# Altium project TIMESTICK_2.1.3.PrjPcb (part 2 of 2)
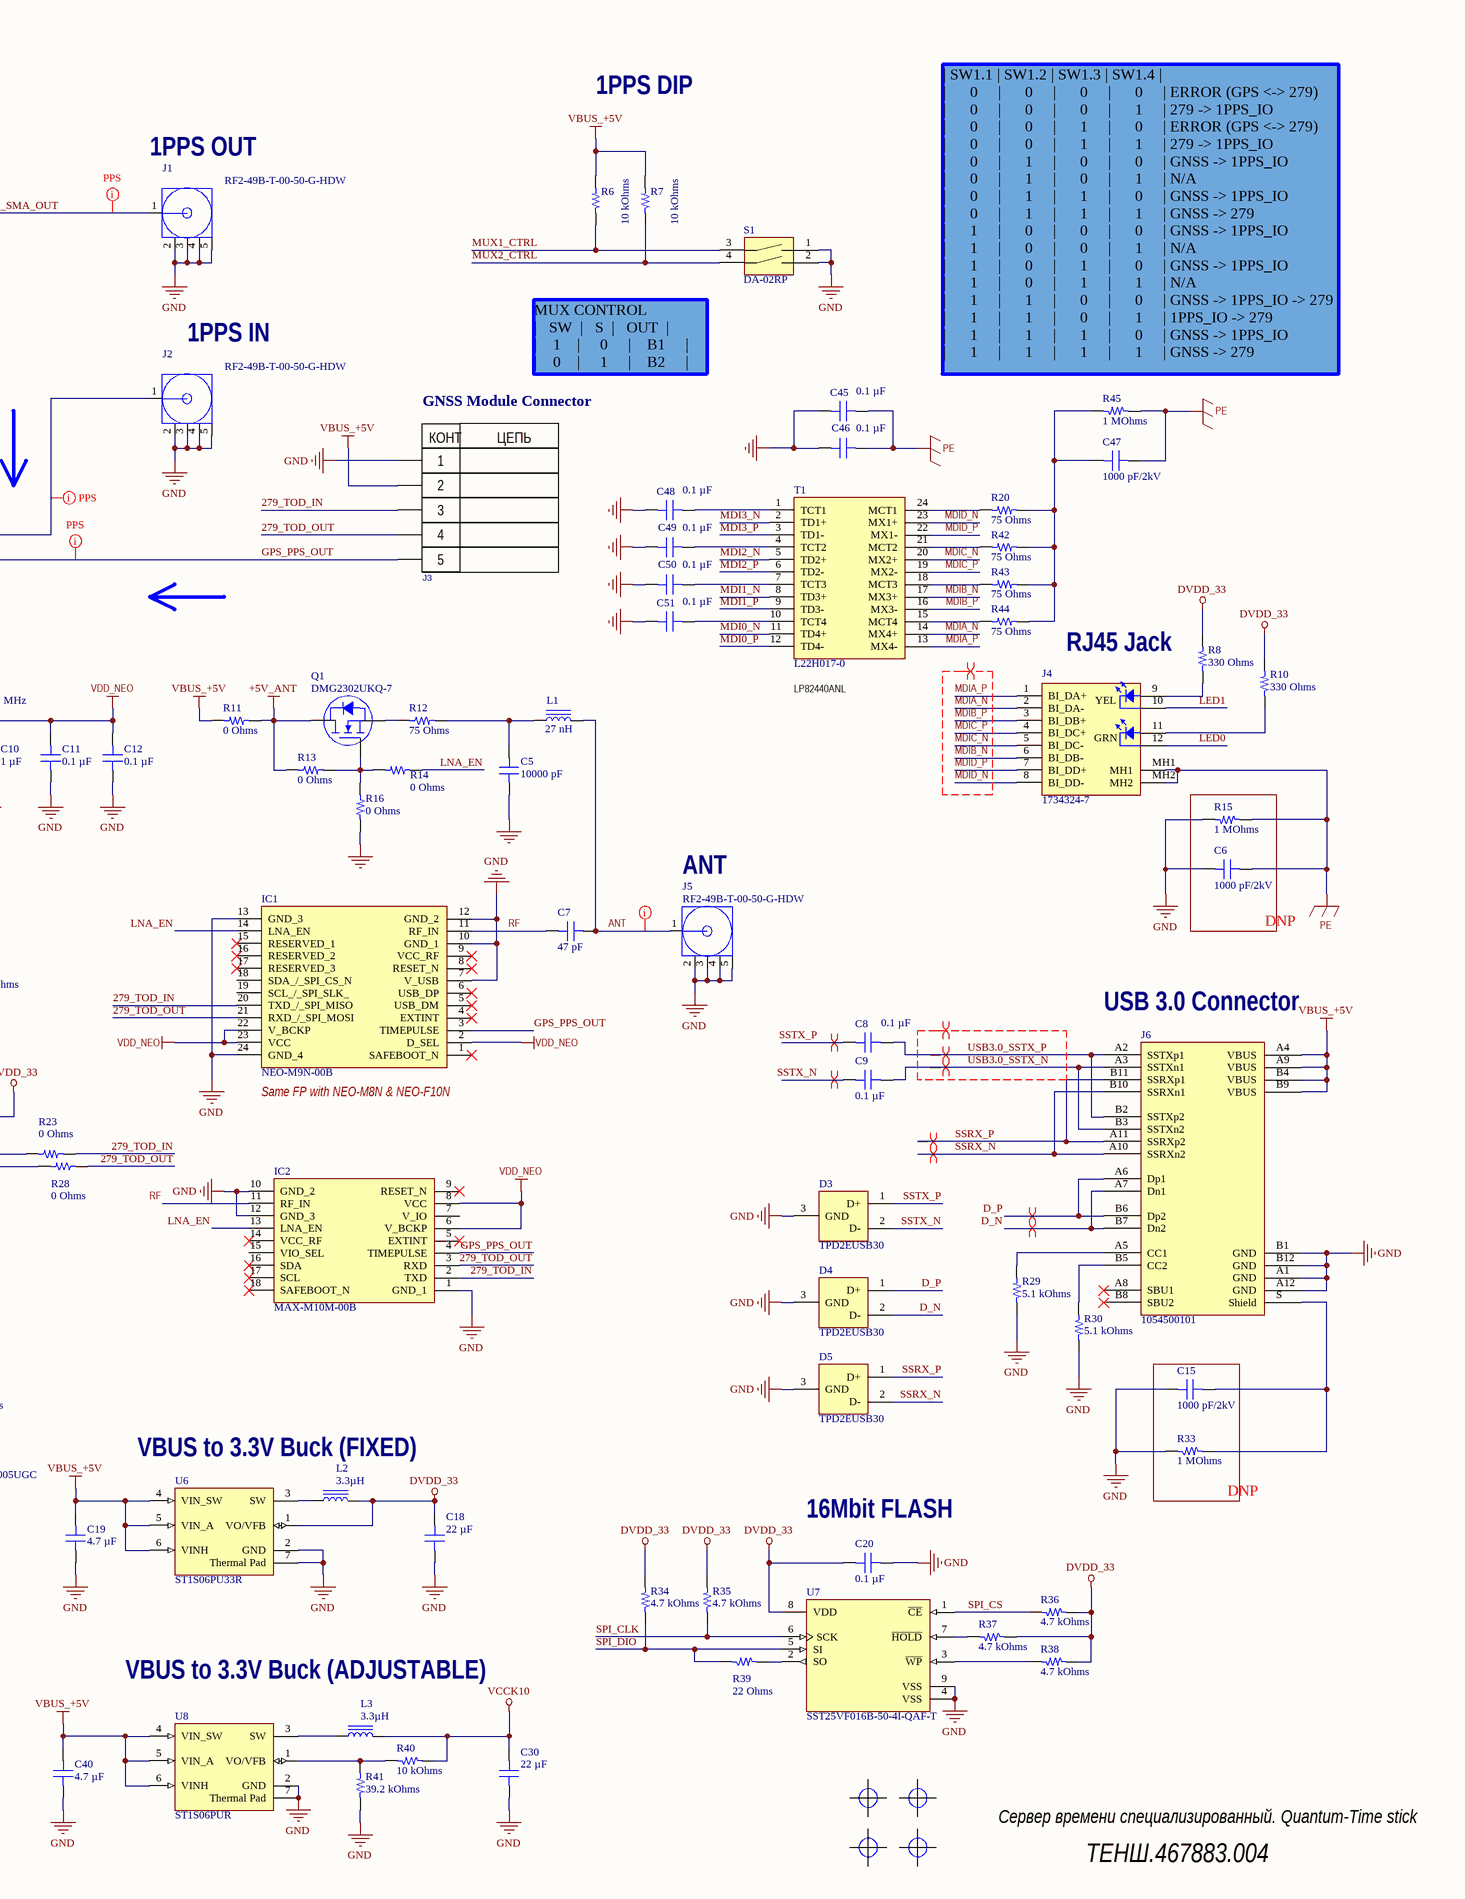
[diagram p2: MAIN.SchDoc, right]

## Sheet MAIN.SchDoc (continued)

### Library data of the parts
C1-C4 C8 C9 C11 C12 C17 C20 C23-C29 C31-C34 C36-C39 C41-C46 C48-C51 = CC0402KRX7R6BB104: CAP CER 0.1UF 10V X7R 0402; manufacturer: Yageo; Tolerance: ±10%; packaging: CutTape; Capacitance: 0.1 µF; Value: 0.1 µF; series: CC; Part Number: CC0402KRX7R6BB104; Applications: General Purpose; componentlink1description: Datasheet; componentlink1url: https://www.yageo.com/upload/media/product/productsearch/datasheet/mlcc/UPY-GPHC_X7R_6.3V-to-50V_18.pdf; componentlink2description: DigiKey Link; componentlink2url: https://www.digikey.com/en/products/detail/yageo/CC0402KRX7R6BB104/2103083; Device Package: 0402 (1005 Metric); lastupdated: 09.02.2024 20:04:34; Lifecycle Status: Active; Minimum Order: 10; Mounting Type: Surface Mount, MLCC; Operating Temperature: -55°C ~ 125°C; Package / Case: 0402 (1005 Metric); partid: 3877; Part Status: Active; price: 0.01; Size / Dimension: 0.039" L x 0.020" W (1.00mm x 0.50mm); Supplier 1: DigiKey; Supplier Part Number 1: 311-1345-1-ND; Temperature Coefficient: X7R; Thickness (Max): 0.022" (0.55mm); Voltage - Rated: 10V
C5 = CC0402KRX7R9BB103: CAP CER 10000PF 50V X7R 0402; manufacturer: Yageo; Tolerance: ±10%; Part Number: CC0402KRX7R9BB103; Value: 10000 pF; Applications: General Purpose; Capacitance: 10000 pF; componentlink1description: Datasheet; componentlink1url: https://www.yageo.com/upload/media/product/productsearch/datasheet/mlcc/UPY-GPHC_X7R_6.3V-to-50V_18.pdf; componentlink2description: DigiKey Link; componentlink2url: https://www.digikey.com/en/products/detail/yageo/CC0402KRX7R9BB103/2103087; Device Package: 0402 (1005 Metric); lastupdated: 09.02.2024 20:04:30; Lifecycle Status: Active; Minimum Order: 10; Mounting Type: Surface Mount, MLCC; Operating Temperature: -55°C ~ 125°C; Package / Case: 0402 (1005 Metric); packaging: CutTape; partid: 6681; Part Status: Active; price: 0.01; series: CC; Size / Dimension: 0.039" L x 0.020" W (1.00mm x 0.50mm); Supplier 1: DigiKey; Supplier Part Number 1: 311-1349-1-ND; Temperature Coefficient: X7R; Thickness (Max): 0.022" (0.55mm); Voltage - Rated: 50V
C6 C15 C47 = CC1206KKX7RDBB102: CAP CER 1000PF 2KV X7R 1206; manufacturer: Yageo; Tolerance: ±10%; Voltage - Rated: 2000V (2kV); Part Number: CC1206KKX7RDBB102; Value: 1000 pF/2kV; Applications: General Purpose; Capacitance: 1000 pF; componentlink1description: Datasheet; componentlink1url: https://www.yageo.com/upload/media/product/productsearch/datasheet/mlcc/UPY-NP0X7R_HV_1KV-to-3KV_11.pdf; componentlink2description: DigiKey Link; componentlink2url: https://www.digikey.com/en/products/detail/yageo/CC1206KKX7RDBB102/2833652; Device Package: 1206 (3216 Metric); Features: High Voltage; lastupdated: 04.06.2024 19:10:41; Lifecycle Status: Active; Minimum Order: 1; Mounting Type: Surface Mount, MLCC; Operating Temperature: -55°C ~ 125°C; Package / Case: 1206 (3216 Metric); packaging: TapeAndReel; partid: 19484; Part Status: Active; price: 0.06; series: CC; Size / Dimension: 0.126" L x 0.063" W (3.20mm x 1.60mm); Supplier 1: DigiKey; Supplier Part Number 1: 311-1487-1-ND; Temperature Coefficient: X7R; Thickness (Max): 0.057" (1.45mm)
C7 = CC0402KRNPO9BN470: CAP CER 47PF 50V C0G/NPO 0402; manufacturer: Yageo; Tolerance: ±10%; Temperature Coefficient: C0G, NP0; Value: 47 pF; Capacitance: 47 pF; componentlink2description: DigiKey Link; componentlink2url: https://www.digikey.com/en/products/detail/yageo/CC0402KRNPO9BN470/5883324; Part Number: CC0402KRNPO9BN470; Applications: General Purpose; componentlink1description: Datasheet; componentlink1url: https://www.yageo.com/upload/media/product/productsearch/datasheet/mlcc/UPY-GP_NP0_16V-to-50V_17.pdf; Device Package: 0402 (1005 Metric); lastupdated: 09.02.2024 20:04:34; Lifecycle Status: Active; Minimum Order: 10; Mounting Type: Surface Mount, MLCC; Operating Temperature: -55°C ~ 125°C; Package / Case: 0402 (1005 Metric); packaging: CutTape; partid: 3939; Part Status: Active; price: 0.01; series: CC; Size / Dimension: 0.039" L x 0.020" W (1.00mm x 0.50mm); Supplier 1: DigiKey; Supplier Part Number 1: 311-3783-1-ND; Thickness (Max): 0.022" (0.55mm); Voltage - Rated: 50V
C10 C16 = CC0402KRX5R6BB105: CAP CER 1UF 10V X5R 0402; manufacturer: Yageo; Tolerance: ±10%; packaging: TapeAndReel; Capacitance: 1 µF; Value: 1 µF; series: CC; Part Number: CC0402KRX5R6BB105; Applications: General Purpose; componentlink1description: Datasheet; componentlink1url: https://www.yageo.com/upload/media/product/productsearch/datasheet/mlcc/UPY-GPHC_X5R_4V-to-50V_25.pdf; componentlink2description: DigiKey Link; componentlink2url: https://www.digikey.com/en/products/detail/yageo/CC0402KRX5R6BB105/2833604; Device Package: 0402 (1005 Metric); lastupdated: 09.02.2024 20:04:31; Lifecycle Status: Active; Minimum Order: 1; Mounting Type: Surface Mount, MLCC; Operating Temperature: -55°C ~ 85°C; Package / Case: 0402 (1005 Metric); partid: 44232; Part Status: Active; price: 0.01; Size / Dimension: 0.039" L x 0.020" W (1.00mm x 0.50mm); Supplier 1: DigiKey; Supplier Part Number 1: 311-1439-1-ND; Temperature Coefficient: X5R; Thickness (Max): 0.022" (0.55mm); Voltage - Rated: 10V
C13 C14 = CC0402KRNPO9BN150: CAP CER 15PF 50V C0G/NPO 0402; manufacturer: Yageo; Tolerance: ±10%; Temperature Coefficient: C0G, NP0; Value: 15 pF; Capacitance: 15 pF; componentlink2description: DigiKey Link; componentlink2url: https://www.digikey.com/en/products/detail/yageo/CC0402KRNPO9BN150/5883321; Part Number: CC0402KRNPO9BN150; Applications: General Purpose; componentlink1description: Datasheet; componentlink1url: https://www.yageo.com/upload/media/product/productsearch/datasheet/mlcc/UPY-GP_NP0_16V-to-50V_17.pdf; Device Package: 0402 (1005 Metric); lastupdated: 09.02.2024 20:04:34; Lifecycle Status: Active; Minimum Order: 10; Mounting Type: Surface Mount, MLCC; Operating Temperature: -55°C ~ 125°C; Package / Case: 0402 (1005 Metric); packaging: CutTape; partid: 3947; Part Status: Active; price: 0.01; series: CC; Size / Dimension: 0.039" L x 0.020" W (1.00mm x 0.50mm); Supplier 1: DigiKey; Supplier Part Number 1: 311-3780-1-ND; Thickness (Max): 0.022" (0.55mm); Voltage - Rated: 50V
C18 C30 = CC0603MRX5R6BB226: CAP CER 22UF 10V X5R 0603; manufacturer: Yageo; Tolerance: ±20%; packaging: TapeAndReel; Package / Case: 0603 (1608 Metric); Voltage - Rated: 10V; Operating Temperature: -55°C ~ 85°C; Applications: General Purpose; Mounting Type: Surface Mount, MLCC; Size / Dimension: 0.063" L x 0.031" W (1.60mm x 0.80mm); Capacitance: 22 µF; series: CC; Thickness (Max): 0.035" (0.90mm); Temperature Coefficient: X5R; Value: 22 µF; componentlink1url: https://www.yageo.com/upload/media/product/productsearch/datasheet/mlcc/UPY-GPHC_X5R_4V-to-50V_26.pdf; componentlink1description: Datasheet; componentlink2url: https://www.digikey.com/en/products/detail/yageo/CC0603MRX5R6BB226/5195226; componentlink2description: DigiKey Link; Part Number: CC0603MRX5R6BB226; Device Package: 0603 (1608 Metric); lastupdated: 09.02.2024 20:09:50; Lifecycle Status: Active; Minimum Order: 1; partid: 45305; Part Status: Active; price: 0.16; Supplier 1: DigiKey; Supplier Part Number 1: 311-1819-1-ND
C19 C21 C22 C35 C40 = CC0402MRX5R6BB475: CAP CER 4.7UF 10V X5R 0402; manufacturer: Yageo; Tolerance: ±20%; packaging: TapeAndReel; Capacitance: 4.7 µF; Value: 4.7 µF; series: CC; componentlink1url: https://www.yageo.com/upload/media/product/productsearch/datasheet/mlcc/UPY-GPHC_X5R_4V-to-50V_25.pdf; componentlink1description: Datasheet; componentlink2url: https://www.digikey.com/en/products/detail/yageo/CC0402MRX5R6BB475/5195143; componentlink2description: DigiKey Link; Part Number: CC0402MRX5R6BB475; Applications: General Purpose; Device Package: 0402 (1005 Metric); lastupdated: 09.02.2024 20:04:16; Lifecycle Status: Active; Minimum Order: 1; Mounting Type: Surface Mount, MLCC; Operating Temperature: -55°C ~ 85°C; Package / Case: 0402 (1005 Metric); partid: 27083; Part Status: Active; price: 0.01; Size / Dimension: 0.039" L x 0.020" W (1.00mm x 0.50mm); Supplier 1: DigiKey; Supplier Part Number 1: 311-1734-1-ND; Temperature Coefficient: X5R; Thickness (Max): 0.026" (0.65mm); Voltage - Rated: 10V
D1 D2 = L-1154GT: LED, 3mm, Green; Manufacturer_Name: Kingbright; Datasheet Link: https://static.chipdip.ru/lib/195/DOC000195138.pdf; Manufacturer_Part_Number: L-1154GT; Mouser Part Number: N/A; Mouser Price/Stock: https://www.mouser.co.uk/ProductDetail/Kingbright/L-1154GT?qs=2JU0tDl2GZ2IKSfxbyKuMQ%3D%3D
D3-D5 = TPD2EUSB30ADRTR: TVS DIODE 3.6VWM 8VC SOT3; Manufacturer_Name: Texas Instruments; Datasheet Link: http://www.ti.com/lit/gpn/tpd2eusb30a; Manufacturer_Part_Number: TPD2EUSB30ADRTR; Mouser Part Number: 595-TPD2EUSB30ADRTR; Mouser Price/Stock: https://www.mouser.co.uk/ProductDetail/Texas-Instruments/TPD2EUSB30ADRTR?qs=O1HRStiETCgOfMa6oTfOlg%3D%3D; Arrow Part Number: TPD2EUSB30ADRTR; Arrow Price/Stock: https://www.arrow.com/en/products/tpd2eusb30adrtr/texas-instruments?utm_currency=USD&region=nac
D6 D7 = APHHS1005ZGC: LED GREEN CLEAR CHIP SMD; Manufacturer: Kingbright; Configuration: Standard; Current - Test: 20mA; Lens Color: Colorless; Lens Size: 0.80mm x 0.50mm; Lens Style: Rectangle with Flat Top; Millicandela Rating: 450mcd; Viewing Angle: 120°; Voltage - Forward (Vf) (Typ): 3.3V; Wavelength - Dominant: 525nm; Wavelength - Peak: 515nm; Part Number: APHHS1005ZGC; Color: Green; ComponentLink1Description: Datasheet; ComponentLink1URL: http://www.kingbrightusa.com/images/catalog/SPEC/APHHS1005ZGC.pdf; ComponentLink2Description: DigiKey Link; ComponentLink2URL: https://www.digikey.com/en/products/detail/kingbright/APHHS1005ZGC/2263569; Device Package: 0402 (1005 Metric); Height (Max): 0.50mm; LastUpdated: 03.06.2024 19:58:14; Lens Transparency: Clear; Lifecycle Status: Active; Minimum Order: 1; Mounting Type: Surface Mount; Package / Case: 0402 (1005 Metric); Packaging: TapeAndReel; PartId: 706; Part Status: Active; Price: 0.18; Series: -; Size / Dimension: 1.00mm L x 0.50mm W; Supplier 1: DigiKey; Supplier Part Number 1: 754-1503-1-ND; Supplier Device Package: Chip LED; Value: Green
FB1-FB5 = BLM15PD800SN1D: FERRITE BEAD 80 OHM 0402 1LN; Manufacturer: Murata Electronics; Number of Lines: 1; Current Rating (Max): 1.5A; DC Resistance (DCR) (Max): 70mOhm; Filter Type: Power Line; Packaging: TapeAndReel; Series: EMIFIL®, BLM15; ComponentLink1URL: https://www.murata.com/en-us/products/productdata/8796740059166/ENFA0018.pdf; ComponentLink1Description: Datasheet; ComponentLink2URL: https://www.digikey.com/en/products/detail/murata-electronics/BLM15PD800SN1D/1948308; ComponentLink2Description: DigiKey Link; Part Number: BLM15PD800SN1D; Device Package: 0402 (1005 Metric); Height (Max): 0.022" (0.55mm); Impedance @ Frequency: 80 Ohms @ 100 MHz; LastUpdated: 03.06.2024 19:51:04; Lifecycle Status: Active; Minimum Order: 1; Mounting Type: Surface Mount; Operating Temperature: -55°C ~ 125°C; Package / Case: 0402 (1005 Metric); PartId: 403; Part Status: Active; Price: 0.02; Size / Dimension: 0.039" L x 0.022" W (1.00mm x 0.55mm); Supplier 1: DigiKey; Supplier Part Number 1: 490-5202-1-ND; Value: 80 Ohms @ 100 MHz
IC1 = NEO-M9N-00B: Integrated Circuit; Manufacturer_Name: u-blox; Datasheet Link: https://content.u-blox.com/sites/default/files/NEO-M9N-00B_DataSheet_UBX-19014285.pdf; Height: 2.6mm; Manufacturer_Part_Number: NEO-M9N-00B; Mouser Part Number: 377-NEO-M9N-00B; Mouser Price/Stock: https://www.mouser.co.uk/ProductDetail/u-blox/NEO-M9N-00B?qs=DPoM0jnrROVeJ6BHpcwcjw%3D%3D; Arrow Part Number: NEO-M9N-00B; Arrow Price/Stock: https://www.arrow.com/en/products/neo-m9n-00b/u-blox?utm_currency=USD&region=nac
IC2 = MAX-M10M-00B: Integrated Circuit; Manufacturer_Name: u-blox; Datasheet Link: https://content.u-blox.com/sites/default/files/documents/MAX-M10M_IntegrationManual_UBX-22038241.pdf; Height: 2.7mm; Manufacturer_Part_Number: MAX-M10M-00B; Mouser Part Number: 377-MAX-M10M-00B; Mouser Price/Stock: https://www.mouser.co.uk/ProductDetail/u-blox/MAX-M10M-00B?qs=A6eO%252BMLsxmQGh8%2FJ1ZmexA%3D%3D
J1 J2 J5 = RF2-49B-T-00-50-G-HDW: Connector; Manufacturer_Name: Adam Tech; Datasheet Link: https://www.digikey.com/en/products/detail/adam-tech/RF2-49B-T-00-50-G-HDW/9831420?msockid=3e3afa68a50969ca3057ef1ca4c9684b; Height: 10.958mm; Manufacturer_Part_Number: RF2-49B-T-00-50-G-HDW; Arrow Part Number: RF2-49B-T-00-50-G-HDW; Arrow Price/Stock: https://www.arrow.com/en/products/rf2-49b-t-00-50-g-hdw/adam-tech?region=nac
J3 = PBS-5: Connector; Manufacturer: Connfly; Part Number: PBD-5; Part Number1: DS-1023-1x5; System: Connector
J4 = 1734324-7: Connector, RJ-45, with LED, w/o Mag, RA; Manufacturer_Name: TE Connectivity; Datasheet Link: https://www.te.com/commerce/DocumentDelivery/DDEController?Action=showdoc&DocId=Customer+Drawing%7F1734324%7FA6%7Fpdf%7FEnglish%7FENG_CD_1734324_A6.pdf%7F1734324-7; Height: 11.6mm; Manufacturer_Part_Number: 1734324-7; Mouser Part Number: 571-1734324-7; Mouser Price/Stock: https://www.mouser.co.uk/ProductDetail/TE-Connectivity/1734324-7?qs=fzsaQExJLyQDhvGFBX%252BpzQ%3D%3D
J6 = 1054500101: CONN RCP USB3.1 TYPEC 24P SMD RA; Manufacturer: Molex; Connector Type: USB - C (Type - C); Current Rating (Amps): 0.25A, 1A, 5A; Gender: Receptacle; Mating Cycles: 10000; Number of Contacts: 24; Number of Ports: 1; Shielding: Shielded; Specifications: USB 3.1 (USB 3.1 Gen 2, Superspeed+); Voltage - Rated: 30VAC/DC; Part Number: 1054500101; ComponentLink1Description: Datasheet; ComponentLink1URL: https://www.molex.com/pdm_docs/ps/PS-105448-001.pdf; ComponentLink2Description: DigiKey Link; ComponentLink2URL: http://digikey.com/product-detail/en/molex/1054500101/WM12856CT-ND/5843891; LastUpdated: 06.06.2020 2:14:04; Lifecycle Status: Active; Minimum Order: 1; Mounting Feature: Horizontal; Mounting Type: Surface Mount, Right Angle; Through Hole; Operating Temperature: -30°C ~ 85°C; Packaging: TapeAndReel; Part Status: Active; Price: 1.22; Series: 105445; Supplier 1: DigiKey; Supplier Part Number 1: WM12856CT-ND; Termination: Solder
L1 = LQG15HS27NJ02D: FIXED IND 27NH 350MA 0.46OHM SMD; Manufacturer: Murata Electronics; DC Resistance (DCR): 460mOhm Max; Frequency - Self Resonant: 1.7GHz; Inductance Frequency - Test: 100 MHz; Material - Core: Air; Q @ Freq: 8 @ 100MHz; Shielding: Unshielded; Tolerance: ±5%; Type: Multilayer; Part Number: LQG15HS27NJ02D; ComponentLink1Description: Datasheet; ComponentLink1URL: https://search.murata.co.jp/Ceramy/image/img/P02/JELF243B-0010.pdf; ComponentLink2Description: DigiKey Link; ComponentLink2URL: https://www.digikey.com/en/products/detail/murata-electronics/LQG15HS27NJ02D/662877; Current Rating (Amps): 350 mA; Device Package: 0402 (1005 Metric); Height - Seated (Max): 0.022" (0.55mm); Inductance: 27 nH; LastUpdated: 19.07.2024 23:59:52; Lifecycle Status: Active; Minimum Order: 1; Mounting Type: Surface Mount; Operating Temperature: -55°C ~ 125°C; Package / Case: 0402 (1005 Metric); Packaging: TapeAndReel; PartId: 2962; Part Status: Active; Price: 0.02; Series: LQG15; Size / Dimension: 0.039" L x 0.020" W (1.00mm x 0.50mm); Supplier 1: DigiKey; Supplier Part Number 1: 490-2628-1-ND; Supplier Device Package: 0402 (1005 Metric); Value: 27 nH
L2 L3 = LQM2HPN3R3MG0L: FIXED IND 3.3UH 1.2A 100 MOHM; Manufacturer: Murata Electronics; Shielding: Shielded; Tolerance: ±20%; DC Resistance (DCR): 125mOhm Max; Frequency - Self Resonant: 30MHz; Inductance Frequency - Test: 1MHz; Material - Core: Ferrite; Type: Multilayer; Inductance: 3.3µH; Packaging: TapeAndReel; Series: LQM2; Height - Seated (Max): 0.039" (1.00mm); Value: 3.3µH; ComponentLink1URL: https://search.murata.co.jp/Ceramy/image/img/P02/JELF243B-0019.pdf; ComponentLink1Description: Datasheet; ComponentLink2URL: http://digikey.com/product-detail/en/murata-electronics/LQM2HPN3R3MG0L/490-5115-1-ND/1893678; ComponentLink2Description: DigiKey Link; Part Number: LQM2HPN3R3MG0L; Current Rating (Amps): 1.2A; Device Package: 1008 (2520 Metric); LastUpdated: 02.09.2020 1:29:06; Lifecycle Status: Active; Minimum Order: 1; Mounting Type: Surface Mount; Operating Temperature: -55°C ~ 125°C; Package / Case: 1008 (2520 Metric); PartId: 3442; Part Status: Active; Price: 0.12; Size / Dimension: 0.098" L x 0.079" W (2.50mm x 2.00mm); Supplier 1: DigiKey; Supplier Part Number 1: 490-5115-1-ND; Supplier Device Package: 1008 (2520 Metric)
MNT1-MNT4 = MOUNT_HOLE: Mount hole
Q1 = DMG2302UKQ-7: MOSFET BVDSS: 8V-24V SOT23 T&R 3; Manufacturer: Diodes Incorporated; Current - Continuous Drain (Id) @ 25°C: 2.8A (Ta); Drain to Source Voltage (Vdss): 20V; Drive Voltage (Max Rds On,  Min Rds On): 2.5V, 4.5V; FET Type: N-Channel; Gate Charge (Qg) (Max) @ Vgs: 2.8nC @ 10V; Input Capacitance (Ciss) (Max) @ Vds: 130pF @ 10V; Power Dissipation (Max): 660mW (Ta); Rds On (Max) @ Id, Vgs: 90mOhm @ 3.6A, 4.5V; Vgs (Max): ±12V; Vgs(th) (Max) @ Id: 1V @ 250µA; Part Number: DMG2302UKQ-7; ComponentLink2Description: DigiKey Link; ComponentLink2URL: http://digikey.com/product-detail/en/diodes-incorporated/DMG2302UKQ-7/31-DMG2302UKQ-7CT-ND/11656546; LastUpdated: 30.08.2020 21:04:43; Lifecycle Status: Active; Minimum Order: 1; Mounting Type: Surface Mount; Operating Temperature: -55°C ~ 150°C (TJ); Package / Case: TO-236-3, SC-59, SOT-23-3; Packaging: TapeAndReel; Price: 0.09; Series: Automotive, AEC-Q101; Supplier 1: DigiKey; Supplier Part Number 1: 31-DMG2302UKQ-7CT-ND; Supplier Device Package: SOT-23; Technology: MOSFET (Metal Oxide)
R1 R2 R4 R5 R31 R32 R34-R38 = RC0402FR-074k7L: RES 4.7K OHM 1% 1/16W 0402; Manufacturer: Yageo; Power (Watts): 0.063W, 1/16W; Temperature Coefficient: ±100ppm/°C; Packaging: CutTape; Composition: Thick Film; Tolerance: ±1%; Resistance: 4.7 kOhms; Value: 4.7 kOhms; Series: RC_L; Number of Terminations: 2; ComponentLink1URL: https://www.yageo.com/upload/media/product/productsearch/datasheet/rchip/PYu-RC_Group_51_RoHS_L_10.pdf; ComponentLink1Description: Datasheet; ComponentLink2URL: https://www.digikey.com/en/products/detail/yageo/RC0402FR-074K7L/2827563; ComponentLink2Description: DigiKey Link; Part Number: RC0402FR-074K7L; Device Package: 0402 (1005 Metric); Features: Moisture Resistant; Height - Seated (Max): 0.016" (0.40mm); LastUpdated: 25.07.2024 9:18:11; Lifecycle Status: Active; Minimum Order: 1; Operating Temperature: -55°C ~ 155°C; Package / Case: 0402 (1005 Metric); PartId: 17603; Part Status: Active; Price: 0.01; Size / Dimension: 0.039" L x 0.020" W (1.00mm x 0.50mm); Supplier 1: DigiKey; Supplier Part Number 1: 311-4.7KLRCT-ND; Supplier Device Package: 0402
R3 R9 R11 R13 R14 R16 R23 R27 R28 = RC0402FR-070RL: RES 0 OHM JUMPER 1/16W 0402; Manufacturer: Yageo; Power (Watts): 0.063W, 1/16W; Packaging: CutTape; Composition: Thick Film; Tolerance: Jumper; Resistance: 0 Ohms; Value: 0 Ohms; Series: RC_L; Number of Terminations: 2; ComponentLink1URL: https://www.yageo.com/upload/media/product/productsearch/datasheet/rchip/PYu-RC_Group_51_RoHS_L_10.pdf; ComponentLink1Description: Datasheet; ComponentLink2URL: https://www.digikey.com/en/products/detail/yageo/RC0402FR-070RL/2827570; ComponentLink2Description: DigiKey Link; Part Number: RC0402FR-070RL; Device Package: 0402 (1005 Metric); Features: Moisture Resistant; Height - Seated (Max): 0.016" (0.40mm); LastUpdated: 25.07.2024 9:18:11; Lifecycle Status: Active; Minimum Order: 1; Operating Temperature: -55°C ~ 155°C; Package / Case: 0402 (1005 Metric); PartId: 17630; Part Status: Active; Price: 0.01; Size / Dimension: 0.039" L x 0.020" W (1.00mm x 0.50mm); Supplier 1: DigiKey; Supplier Part Number 1: 311-0.0LRCT-ND; Supplier Device Package: 0402
R6 R7 R19 R40 = RC0402FR-0710KL: RES 10K OHM 1% 1/16W 0402; Manufacturer: Yageo; Power (Watts): 0.063W, 1/16W; Temperature Coefficient: ±100ppm/°C; Packaging: CutTape; Composition: Thick Film; Tolerance: ±1%; Resistance: 10 kOhms; Value: 10 kOhms; Series: RC_L; Number of Terminations: 2; ComponentLink1URL: https://www.yageo.com/upload/media/product/productsearch/datasheet/rchip/PYu-RC_Group_51_RoHS_L_10.pdf; ComponentLink1Description: Datasheet; ComponentLink2URL: https://www.digikey.com/en/products/detail/yageo/RC0402FR-0710KL/726523; ComponentLink2Description: DigiKey Link; Part Number: RC0402FR-0710KL; Device Package: 0402 (1005 Metric); Features: Moisture Resistant; Height - Seated (Max): 0.016" (0.40mm); LastUpdated: 25.07.2024 9:18:11; Lifecycle Status: Active; Minimum Order: 1; Operating Temperature: -55°C ~ 155°C; Package / Case: 0402 (1005 Metric); PartId: 17593; Part Status: Active; Price: 0.01; Size / Dimension: 0.039" L x 0.020" W (1.00mm x 0.50mm); Supplier 1: DigiKey; Supplier Part Number 1: 311-10.0KLRCT-ND; Supplier Device Package: 0402
R8 R10 R46 R47 = RC0402FR-07330RL: RES 330 OHM 1% 1/16W 0402; Manufacturer: Yageo; Power (Watts): 0.063W, 1/16W; Temperature Coefficient: ±100ppm/°C; Packaging: CutTape; Composition: Thick Film; Tolerance: ±1%; Resistance: 330 Ohms; Value: 330 Ohms; Series: RC_L; Number of Terminations: 2; ComponentLink1URL: https://www.yageo.com/upload/media/product/productsearch/datasheet/rchip/PYu-RC_Group_51_RoHS_L_10.pdf; ComponentLink1Description: Datasheet; ComponentLink2URL: https://www.digikey.com/en/products/detail/yageo/RC0402FR-07330RL/726594; ComponentLink2Description: DigiKey Link; Part Number: RC0402FR-07330RL; Device Package: 0402 (1005 Metric); Features: Moisture Resistant; Height - Seated (Max): 0.016" (0.40mm); LastUpdated: 25.07.2024 9:18:08; Lifecycle Status: Active; Minimum Order: 1; Operating Temperature: -55°C ~ 155°C; Package / Case: 0402 (1005 Metric); PartId: 20556; Part Status: Active; Price: 0.01; Size / Dimension: 0.039" L x 0.020" W (1.00mm x 0.50mm); Supplier 1: DigiKey; Supplier Part Number 1: 311-330LRCT-ND; Supplier Device Package: 0402
R12 R20 R42-R44 = RC0603FR-0775RL: RES 75 OHM 1% 1/10W 0603; Manufacturer: Yageo; Power (Watts): 0.1W, 1/10W; Temperature Coefficient: ±100ppm/°C; Part Number: RC0603FR-0775RL; Value: 75 Ohms; ComponentLink1Description: Datasheet; ComponentLink1URL: https://www.yageo.com/upload/media/product/productsearch/datasheet/rchip/PYu-RC_Group_51_RoHS_L_10.pdf; ComponentLink2Description: DigiKey Link; ComponentLink2URL: https://www.digikey.com/en/products/detail/yageo/RC0603FR-0775RL/727377; Composition: Thick Film; Device Package: 0603 (1608 Metric); Features: Moisture Resistant; Height - Seated (Max): 0.022" (0.55mm); LastUpdated: 25.07.2024 9:19:21; Lifecycle Status: Active; Minimum Order: 1; Number of Terminations: 2; Operating Temperature: -55°C ~ 155°C; Package / Case: 0603 (1608 Metric); Packaging: CutTape; PartId: 18934; Part Status: Active; Price: 0.01; Resistance: 75 Ohms; Series: RC_L; Size / Dimension: 0.063" L x 0.031" W (1.60mm x 0.80mm); Supplier 1: DigiKey; Supplier Part Number 1: 311-75.0HRCT-ND; Supplier Device Package: 0603; Tolerance: ±1%
R15 R33 R45 = RC0402FR-071ML: RES 1M OHM 1% 1/16W 0402; Manufacturer: Yageo; Power (Watts): 0.063W, 1/16W; Temperature Coefficient: ±100ppm/°C; Packaging: CutTape; Composition: Thick Film; Tolerance: ±1%; Resistance: 1 MOhms; Value: 1 MOhms; Series: RC_L; Number of Terminations: 2; ComponentLink1URL: https://www.yageo.com/upload/media/product/productsearch/datasheet/rchip/PYu-RC_Group_51_RoHS_L_10.pdf; ComponentLink1Description: Datasheet; ComponentLink2URL: https://www.digikey.com/en/products/detail/yageo/RC0402FR-071ML/726515; ComponentLink2Description: DigiKey Link; Part Number: RC0402FR-071ML; Device Package: 0402 (1005 Metric); Features: Moisture Resistant; Height - Seated (Max): 0.016" (0.40mm); LastUpdated: 25.07.2024 9:18:11; Lifecycle Status: Active; Minimum Order: 1; Operating Temperature: -55°C ~ 155°C; Package / Case: 0402 (1005 Metric); PartId: 17592; Part Status: Active; Price: 0.01; Size / Dimension: 0.039" L x 0.020" W (1.00mm x 0.50mm); Supplier 1: DigiKey; Supplier Part Number 1: 311-1.00MLRCT-ND; Supplier Device Package: 0402
R17 = RC0402FR-0749K9L: RES 49.9K OHM 1% 1/16W 0402; Manufacturer: Yageo; Power (Watts): 0.063W, 1/16W; Temperature Coefficient: ±100ppm/°C; Packaging: CutTape; Composition: Thick Film; Tolerance: ±1%; Resistance: 49.9 kOhms; Value: 49.9 kOhms; Series: RC_L; Number of Terminations: 2; ComponentLink1URL: https://www.yageo.com/upload/media/product/productsearch/datasheet/rchip/PYu-RC_Group_51_RoHS_L_10.pdf; ComponentLink1Description: Datasheet; ComponentLink2URL: https://www.digikey.com/en/products/detail/yageo/RC0402FR-0749K9L/726620; ComponentLink2Description: DigiKey Link; Part Number: RC0402FR-0749K9L; Device Package: 0402 (1005 Metric); Features: Moisture Resistant; Height - Seated (Max): 0.016" (0.40mm); LastUpdated: 25.07.2024 9:18:11; Lifecycle Status: Active; Minimum Order: 1; Operating Temperature: -55°C ~ 155°C; Package / Case: 0402 (1005 Metric); PartId: 17919; Part Status: Active; Price: 0.01; Size / Dimension: 0.039" L x 0.020" W (1.00mm x 0.50mm); Supplier 1: DigiKey; Supplier Part Number 1: 311-49.9KLRCT-ND; Supplier Device Package: 0402
R18 = RC0402FR-07100KL: RES 100K OHM 1% 1/16W 0402; Manufacturer: Yageo; Power (Watts): 0.063W, 1/16W; Temperature Coefficient: ±100ppm/°C; Packaging: CutTape; Composition: Thick Film; Tolerance: ±1%; Resistance: 100 kOhms; Value: 100 kOhms; Series: RC_L; Number of Terminations: 2; ComponentLink1URL: https://www.yageo.com/upload/media/product/productsearch/datasheet/rchip/PYu-RC_Group_51_RoHS_L_10.pdf; ComponentLink1Description: Datasheet; ComponentLink2URL: https://www.digikey.com/en/products/detail/yageo/RC0402FR-07100KL/726526; ComponentLink2Description: DigiKey Link; Part Number: RC0402FR-07100KL; Device Package: 0402 (1005 Metric); Features: Moisture Resistant; Height - Seated (Max): 0.016" (0.40mm); LastUpdated: 25.07.2024 9:18:11; Lifecycle Status: Active; Minimum Order: 1; Operating Temperature: -55°C ~ 155°C; Package / Case: 0402 (1005 Metric); PartId: 17595; Part Status: Active; Price: 0.01; Size / Dimension: 0.039" L x 0.020" W (1.00mm x 0.50mm); Supplier 1: DigiKey; Supplier Part Number 1: 311-100KLRCT-ND; Supplier Device Package: 0402
R21 = RC0402FR-0724KL: RES 24K OHM 1% 1/16W 0402; Manufacturer: Yageo; Power (Watts): 0.063W, 1/16W; Temperature Coefficient: ±100ppm/°C; Packaging: CutTape; Composition: Thick Film; Tolerance: ±1%; Resistance: 24 kOhms; Value: 24 kOhms; Series: RC_L; Number of Terminations: 2; ComponentLink1URL: https://www.yageo.com/upload/media/product/productsearch/datasheet/rchip/PYu-RC_Group_51_RoHS_L_10.pdf; ComponentLink1Description: Datasheet; ComponentLink2URL: https://www.digikey.com/en/products/detail/yageo/RC0402FR-0724KL/2827581; ComponentLink2Description: DigiKey Link; Part Number: RC0402FR-0724KL; Device Package: 0402 (1005 Metric); Features: Moisture Resistant; Height - Seated (Max): 0.016" (0.40mm); LastUpdated: 25.07.2024 9:18:19; Lifecycle Status: Active; Minimum Order: 1; Operating Temperature: -55°C ~ 155°C; Package / Case: 0402 (1005 Metric); PartId: 2562; Part Status: Active; Price: 0.01; Size / Dimension: 0.039" L x 0.020" W (1.00mm x 0.50mm); Supplier 1: DigiKey; Supplier Part Number 1: 311-24KLRCT-ND; Supplier Device Package: 0402
R22 R24 R25 = RC0402FR-0747KL: RES 47K OHM 1% 1/16W 0402; Manufacturer: Yageo; Power (Watts): 0.063W, 1/16W; Temperature Coefficient: ±100ppm/°C; Packaging: CutTape; Composition: Thick Film; Tolerance: ±1%; Resistance: 47 kOhms; Value: 47 kOhms; Series: RC_L; Number of Terminations: 2; ComponentLink1URL: https://www.yageo.com/upload/media/product/productsearch/datasheet/rchip/PYu-RC_Group_51_RoHS_L_10.pdf; ComponentLink1Description: Datasheet; ComponentLink2URL: https://www.digikey.com/en/products/detail/yageo/RC0402FR-0747KL/726616; ComponentLink2Description: DigiKey Link; Part Number: RC0402FR-0747KL; Device Package: 0402 (1005 Metric); Features: Moisture Resistant; Height - Seated (Max): 0.016" (0.40mm); LastUpdated: 25.07.2024 9:18:08; Lifecycle Status: Active; Minimum Order: 1; Operating Temperature: -55°C ~ 155°C; Package / Case: 0402 (1005 Metric); PartId: 20550; Part Status: Active; Price: 0.01; Size / Dimension: 0.039" L x 0.020" W (1.00mm x 0.50mm); Supplier 1: DigiKey; Supplier Part Number 1: 311-47.0KLRCT-ND; Supplier Device Package: 0402
R26 = RC0402FR-07200RL: RES 200 OHM 1% 1/16W 0402; Manufacturer: Yageo; Power (Watts): 0.063W, 1/16W; Temperature Coefficient: ±100ppm/°C; Packaging: CutTape; Composition: Thick Film; Tolerance: ±1%; Resistance: 200 Ohms; Value: 200 Ohms; Series: RC_L; Number of Terminations: 2; ComponentLink1URL: https://www.yageo.com/upload/media/product/productsearch/datasheet/rchip/PYu-RC_Group_51_RoHS_L_10.pdf; ComponentLink1Description: Datasheet; ComponentLink2URL: https://www.digikey.com/en/products/detail/yageo/RC0402FR-07200RL/2827569; ComponentLink2Description: DigiKey Link; Part Number: RC0402FR-07200RL; Device Package: 0402 (1005 Metric); Features: Moisture Resistant; Height - Seated (Max): 0.016" (0.40mm); LastUpdated: 25.07.2024 9:18:11; Lifecycle Status: Active; Minimum Order: 1; Operating Temperature: -55°C ~ 155°C; Package / Case: 0402 (1005 Metric); PartId: 17915; Part Status: Active; Price: 0.01; Size / Dimension: 0.039" L x 0.020" W (1.00mm x 0.50mm); Supplier 1: DigiKey; Supplier Part Number 1: 311-200LRCT-ND; Supplier Device Package: 0402
R29 R30 = RC0402FR-075k1L: RES 5.1K OHM 1% 1/16W 0402; Manufacturer: Yageo; Power (Watts): 0.063W, 1/16W; Temperature Coefficient: ±100ppm/°C; Packaging: CutTape; Composition: Thick Film; Tolerance: ±1%; Resistance: 5.1 kOhms; Value: 5.1 kOhms; Series: RC_L; Number of Terminations: 2; ComponentLink1URL: https://www.yageo.com/upload/media/product/productsearch/datasheet/rchip/PYu-RC_Group_51_RoHS_L_10.pdf; ComponentLink1Description: Datasheet; ComponentLink2URL: https://www.digikey.com/en/products/detail/yageo/RC0402FR-075K1L/726624; ComponentLink2Description: DigiKey Link; Part Number: RC0402FR-075K1L; Device Package: 0402 (1005 Metric); Features: Moisture Resistant; Height - Seated (Max): 0.016" (0.40mm); LastUpdated: 25.07.2024 9:18:11; Lifecycle Status: Active; Minimum Order: 1; Operating Temperature: -55°C ~ 155°C; Package / Case: 0402 (1005 Metric); PartId: 17937; Part Status: Active; Price: 0.01; Size / Dimension: 0.039" L x 0.020" W (1.00mm x 0.50mm); Supplier 1: DigiKey; Supplier Part Number 1: 311-5.10KLRCT-ND; Supplier Device Package: 0402
R39 = RC0402FR-0722RL: RES 22 OHM 1% 1/16W 0402; Manufacturer: Yageo; Power (Watts): 0.063W, 1/16W; Temperature Coefficient: ±100ppm/°C; Packaging: CutTape; Composition: Thick Film; Tolerance: ±1%; Resistance: 22 Ohms; Value: 22 Ohms; Series: RC_L; Number of Terminations: 2; ComponentLink1URL: https://www.yageo.com/upload/media/product/productsearch/datasheet/rchip/PYu-RC_Group_51_RoHS_L_10.pdf; ComponentLink1Description: Datasheet; ComponentLink2URL: https://www.digikey.com/en/products/detail/yageo/RC0402FR-0722RL/726562; ComponentLink2Description: DigiKey Link; Part Number: RC0402FR-0722RL; Device Package: 0402 (1005 Metric); Features: Moisture Resistant; Height - Seated (Max): 0.016" (0.40mm); LastUpdated: 25.07.2024 9:18:11; Lifecycle Status: Active; Minimum Order: 1; Operating Temperature: -55°C ~ 155°C; Package / Case: 0402 (1005 Metric); PartId: 17600; Part Status: Active; Price: 0.01; Size / Dimension: 0.039" L x 0.020" W (1.00mm x 0.50mm); Supplier 1: DigiKey; Supplier Part Number 1: 311-22.0LRCT-ND; Supplier Device Package: 0402
R41 = RC0402FR-0739K2L: RES 39.2K OHM 1% 1/16W 0402; Manufacturer: Yageo; Power (Watts): 0.063W, 1/16W; Temperature Coefficient: ±100ppm/°C; Packaging: CutTape; Composition: Thick Film; Tolerance: ±1%; Resistance: 39.2 kOhms; Value: 39.2 kOhms; Series: RC_L; Number of Terminations: 2; ComponentLink1URL: https://www.yageo.com/upload/media/product/productsearch/datasheet/rchip/PYu-RC_Group_51_RoHS_L_10.pdf; ComponentLink1Description: Datasheet; ComponentLink2URL: https://www.digikey.com/en/products/detail/yageo/RC0402FR-0739K2L/726603; ComponentLink2Description: DigiKey Link; Part Number: RC0402FR-0739K2L; Device Package: 0402 (1005 Metric); Features: Moisture Resistant; Height - Seated (Max): 0.016" (0.40mm); LastUpdated: 25.07.2024 9:18:08; Lifecycle Status: Active; Minimum Order: 1; Operating Temperature: -55°C ~ 155°C; Package / Case: 0402 (1005 Metric); PartId: 20819; Part Status: Active; Price: 0.01; Size / Dimension: 0.039" L x 0.020" W (1.00mm x 0.50mm); Supplier 1: DigiKey; Supplier Part Number 1: 311-39.2KLRCT-ND; Supplier Device Package: 0402
S1 = DA-02RP: DIP Switch, 2P; Manufacturer_Name: XKB Connectivity; Datasheet Link: http://www.helloxkb.com/public/images/pdf/DA-XX-X-X.pdf; Height: 10.1mm; Manufacturer_Part_Number: DA-02RP
T1 = L22H017-0: 2.5G BaseT / Single Port LAN Filter; Manufacturer_Name: UDE; Datasheet Link: https://www.ude-corp.com/archive/product/item/Datasheet/L22H017-0.pdf; Height: 4; Manufacturer_Part_Number: L22H017-0
U1 U3 = NC7WZ125K8X: Integrated Circuit; Manufacturer_Name: onsemi; Datasheet Link: https://www.lcsc.com/datasheet/lcsc_datasheet_2410121813_onsemi-NC7WZ125K8X_C457629.pdf; Height: 0.9mm; Manufacturer_Part_Number: NC7WZ125K8X
U2 U4 = SN74LVC1G3157DBVR: Integrated Circuit; Manufacturer_Name: Texas Instruments; Datasheet Link: http://componentsearchengine.com/Datasheets/1/SN74LVC1G3157DBVR.pdf; Height: 1.45mm; Manufacturer_Part_Number: SN74LVC1G3157DBVR; Mouser Part Number: 595-SN74LVC1G3157DBV; Mouser Price/Stock: https://www.mouser.co.uk/ProductDetail/Texas-Instruments/SN74LVC1G3157DBVR?qs=PVVDbbWpW3ID6l2sElWeMw%3D%3D; Arrow Part Number: SN74LVC1G3157DBVR; Arrow Price/Stock: https://www.arrow.com/en/products/sn74lvc1g3157dbvr/texas-instruments?region=nac
U5 = IC_AX88279
U6 = CMP-0240-00158-1: Synchronous rectification with inhibit, 1.5 A, 1.5 MHz adjustable, step-down switching regulator, 6-Pin DFN; Manufacturer: STMicroelectronics; Min Input Voltage: 2.7V; Number of Outputs: 1; Output Current: 1.5A; Output Voltage: 3.3V; Max Supply Voltage: 6V; Switching Frequency: 1.5MHz; Output Type: Fixed,Adjustable; Quiescent Current: 1.5mA; Efficiency: 90%; Synchronous Rectifier: Yes; Polarity: Positive; Accuracy: 2%; PackageDescription: 6-Pin Plastic, Dual LLP, 3 x 3 mm Body, 0.95 mm Pitch, Exposed Pad; ComponentLink1URL: http://www.st.com; DatasheetVersion: May-2009; ComponentLink2Description: Datasheet; ComponentLink2URL: http://www.st.com/internet/com/TECHNICAL_RESOURCES/TECHNICAL_LITERATURE/DATASHEET/CD00100211.pdf; PackageVersion: 2008; PackageReference: DFN6D; ComponentLink1Description: Manufacturer URL; Supplier: Digikey; Supplier Part Number: 497-6311-1-ND; Manufacturer Part Number: ST1S06PU33R; RoHS: Yes; Category: Voltage Regulators - Switching; Stock: 5274; Pricing: 1=1.46, 10=1.306, 25=1.2392, 100=1.0179, 250=0.95156, 500=0.8409, 1000=0.66387 (USD); Mounting Technology: Surface Mount; Case/Package: DFN; Pins: 6; Weight: 0.000744oz; Min Operating Temperature: -30°C; Max Operating Temperature: 125°C; Packaging: Tape and Reel; Max Output current: 1.5A; Series: -; Package Quantity: 1; Operating Supply Voltage: 6V; Frequency: 1.5MHz; Length: 3.1mm; Width: 3.1mm; Height: 0.95mm; Radiation Hardening: No; Lead Free: Lead Free; RoHS Compliant: Yes; ComponentLink3URL: https://datasheet.ciiva.com/15113/getdatasheetpartid-188384-15113793.pdf?src-supplier=Verical; ComponentLink3Description: https://datasheet.ciiva.com/15113/getdatasheetpartid-188384-15113793.pdf?src-supplier=Verical; ComponentLink4URL: https://datasheet.ciiva.com/2029/cd00100211-2029328.pdf?src-supplier=Digikey; ComponentLink4Description: https://datasheet.ciiva.com/2029/cd00100211-2029328.pdf?src-supplier=Digikey; ComponentLink5URL: https://datasheet.ciiva.com/2029/cd00100211-2029329.pdf?src-supplier=Digikey; ComponentLink5Description: https://datasheet.ciiva.com/2029/cd00100211-2029329.pdf?src-supplier=Digikey; ComponentLink6URL: https://datasheet.ciiva.com/2029/cd00100211-2029330.pdf?src-supplier=Digikey; ComponentLink6Description: https://datasheet.ciiva.com/2029/cd00100211-2029330.pdf?src-supplier=Digikey; ComponentLink7URL: https://datasheet.ciiva.com/16489/cd00100211-16489901.pdf?src-supplier=Future+Electronics; ComponentLink7Description: https://datasheet.ciiva.com/16489/cd00100211-16489901.pdf?src-supplier=Future+Electronics; ComponentLink8URL: https://datasheet.ciiva.com/4905/cd00100211-4905371.pdf?src-supplier=Mouser; ComponentLink8Description: https://datasheet.ciiva.com/4905/cd00100211-4905371.pdf?src-supplier=Mouser
U7 = CMP-00252-18686437-1: SST25VF016B-50-4I-QAF-T Flash Serial-SPI 3.3V 16Mbit 2M x 8bit 8ns 8-Pin WSON EP T/R - Tape and Reel; Max Supply Voltage: 3.6V; Density: 16Mb; Interface: SPI; Memory Size: 2MB; Data Bus Width: 8b; Max Frequency: 50MHz; Nominal Supply Current: 15mA; Address Bus Width: 1b; Min Supply Voltage: 2.7V; Sync/Async: Synchronous; Packaging: Tape and Reel; Operating Supply Voltage: 3.3V; Access Time: 8ns; Lead Free: Lead Free; Height: 800µm; RoHS: Compliant; Max Operating Temperature: 85°C; Lifecycle Status: Production; NexarPartId: 18686437; Frequency: 50MHz; Schedule B: 8542320050, 8542320050; Min Operating Temperature: -40°C; Word Size: 8b; Memory Type: FLASH; Number of Pins: 8; Radiation Hardening: No; Mount: Surface Mount
U8 = CMP-0240-00159-1: Synchronous rectification with inhibit, 1.5 A, 1.5 MHz adjustable, step-down switching regulator, 6-Pin DFN; PackageDescription: 6-Pin Plastic, Dual LLP, 3 x 3 mm Body, 0.95 mm Pitch, Exposed Pad; ComponentLink2URL: http://www.st.com/internet/com/TECHNICAL_RESOURCES/TECHNICAL_LITERATURE/DATASHEET/CD00100211.pdf; ComponentLink1Description: Manufacturer URL; DatasheetVersion: May-2009; ComponentLink1URL: http://www.st.com; ComponentLink2Description: Datasheet; PackageVersion: 2008; PackageReference: DFN6D
Y1 = ABM8G-25.000MHZ-18-D2Y-T: CRYSTAL 25.0000MHZ 18PF SMD; Manufacturer: Abracon LLC; Frequency Stability: ±30ppm; Frequency Tolerance: ±20ppm; ESR (Equivalent Series Resistance): 60 Ohms; Operating Mode: Fundamental; Load Capacitance: 18pF; Packaging: TapeAndReel; Frequency: 25MHz; Series: ABM8G; ComponentLink1URL: https://abracon.com/Resonators/ABM8G.pdf; ComponentLink1Description: Datasheet; ComponentLink2URL: http://digikey.com/product-detail/en/abracon-llc/ABM8G-25.000MHZ-18-D2Y-T/535-10275-1-ND/2218088; ComponentLink2Description: DigiKey Link; Part Number: ABM8G-25.000MHZ-18-D2Y-T; Height - Seated (Max): 0.039" (1.00mm); LastUpdated: 19.03.2020 22:36:25; Lifecycle Status: Active; Minimum Order: 1; Mounting Type: Surface Mount; Operating Temperature: -40°C ~ 85°C; Package / Case: 4-SMD, No Lead; PartId: 354; Part Status: Active; Price: 0.34; Size / Dimension: 0.126" L x 0.098" W (3.20mm x 2.50mm); Supplier 1: DigiKey; Supplier Part Number 1: 535-10275-1-ND; Type: MHz Crystal; Value: 25MHz; Device Package: 4-SMD, No Lead

## Assembly variants
release: not fitted C6 IC2 R3 R9 R15